# Altium project ESP32_Projet.PrjPcb
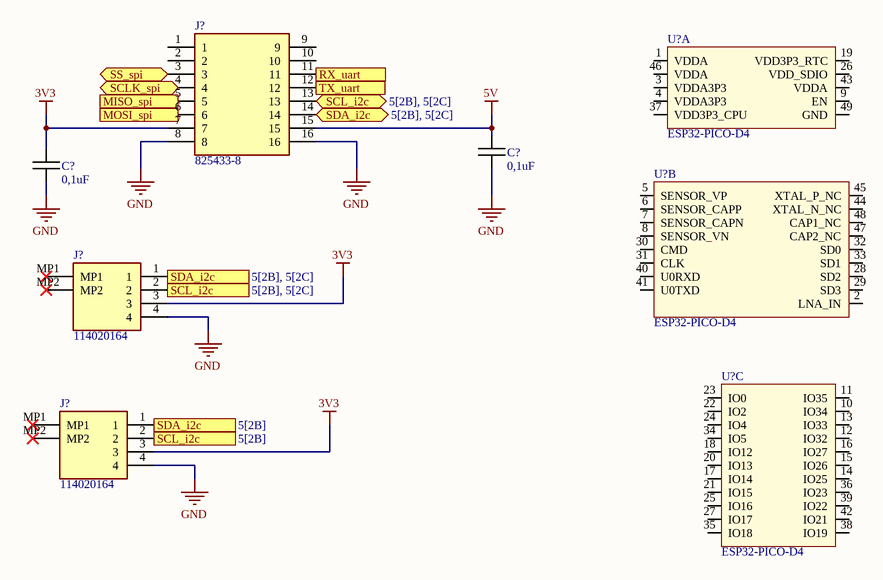
[diagram p0: Sheet6.SchDoc]
5 sheets, 60 parts. Net scope: flat (ports and power ports of the same name join across sheets).
Board file: PCB1.PcbDoc
Sheets:
  Sheet6.SchDoc
  Sheet1.SchDoc
  Sheet2.SchDoc
  Sheet3.SchDoc
  Sheet5.SchDoc

## Sheet Sheet6.SchDoc
size A4; SheetNumber: 5; SheetTotal: 5

### Parts
(Parts that share a designator on the sheet are numbered #1, #2 ... from top to bottom, then left to right.)
C?#1  0,1uF  [CAPC1005X06N]
C?#2  0,1uF  [CAPC1005X06N]
J?#1  825433-8
J?#2  114020164  [114020164]
J?#3  114020164  [114020164]
U?#1  ESP32-PICO-D4  [PQFN50P700X700X104_HS-49N]  (part A of 3)
U?#2  ESP32-PICO-D4  [PQFN50P700X700X104_HS-49N]  (part B of 3)
U?#3  ESP32-PICO-D4  [PQFN50P700X700X104_HS-49N]  (part C of 3)

### Ports
MISO_spi (in), MOSI_spi (out), RX_uart (in), SCL_i2c (bidir, see 5[2B], 5[2C]), SCL_i2c (in, see 5[2B]), SCL_i2c (in, see 5[2B], 5[2C]), SCLK_spi (bidir), SDA_i2c (bidir, see 5[2B], 5[2C]), SDA_i2c (out, see 5[2B]), SDA_i2c (out, see 5[2B], 5[2C]), SS_spi (bidir), TX_uart (out)

### Nets
3V3: C?#2.1 J?#1.7 J?#2.3 J?#3.3
5V: C?#1.1 J?#1.15
GND: C?#1.2 C?#2.2 J?#1.8 J?#1.16 J?#2.4 J?#3.4
NetJ?#1_3: J?#1.3 ; port SS_spi
NetJ?#1_11: J?#1.11 ; port RX_uart
NetJ?#1_12: J?#1.12 ; port TX_uart
NetJ?#1_13: J?#1.13 J?#2.2 J?#3.2 ; port SCL_i2c
NetJ?#1_14: J?#1.14 J?#2.1 J?#3.1 ; port SDA_i2c

Not connected (* = marked no-connect by the designer): J?#1 1 2 4 5 6 9 10; J?#2 MP1* MP2*; J?#3 MP1* MP2*; U?#1 1(VDDA) 3(VDDA3P3) 4(VDDA3P3) 9(EN) 19(VDD3P3_RTC) 26(VDD_SDIO) 37(VDD3P3_CPU) 43(VDDA) 46(VDDA) 49(GND); U?#2 2(LNA_IN) 5(SENSOR_VP) 6(SENSOR_CAPP) 7(SENSOR_CAPN) 8(SENSOR_VN) 28(SD2) 29(SD3) 30(CMD) 31(CLK) 32(SD0) 33(SD1) 40(U0RXD) 41(U0TXD) 44(XTAL_N_NC) 45(XTAL_P_NC) 47(CAP2_NC) 48(CAP1_NC); U?#3 10(IO34) 11(IO35) 12(IO32) 13(IO33) 14(IO25) 15(IO26) 16(IO27) 17(IO14) 18(IO12) 20(IO13) 21(IO15) 22(IO2) 23(IO0) 24(IO4) 25(IO16) 27(IO17) 34(IO5) 35(IO18) 36(IO23) 38(IO19) 39(IO22) 42(IO21)

### Library data of the parts
C?#1 C?#2 = Capacitor
J?#1 = Connect-Mikronus: Headers & Wire Housings 8P double for connection mikrobus; Manufacturer_Name: TE Connectivity; Manufacturer_Part_Number: 825433-8; Mouser Part Number: 571-825433-8
J?#2 J?#3 = 114020164: Seeed Studio Accessories Grove Female Header - SMD-4P-2.0mm-90D-20Pcs; Manufacturer_Name: Seeed Studio; Manufacturer_Part_Number: 114020164; Mouser Part Number: 713-114020164
U?#1-U?#3 = ESP32: Système RF sur puce - SoC SIP module ESP32 with 4MByte Flash, Dual Core MCU, Wi-Fi & Bluetooth Combo, LGA48-pin, 7*7mm; Manufacturer 1: Espressif Systems; Supplier 1: Digi-Key; Supplier Part Number 1: 1904-1029-1-ND; Manufacturer Part Number 1: ESP32-PICO-D4

## Sheet Sheet1.SchDoc: Projet M1 2024
size A4; DrawnBy: J.CLEMENT & D.FOURNIER; DocumentNumber: 1; Revision: V1.0 Rev A; SheetNumber: 2; SheetTotal: 5
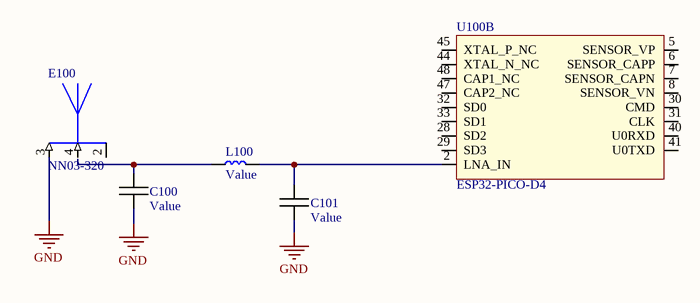
[diagram p1: Sheet1.SchDoc]

### Parts
C100  Value  [CAPC1005X06N]
C101  Value  [CAPC1005X06N]
E100  NN03-320  [XCVR_NN03-320]
L100  Value  [LQPC1005X06N]
U100  ESP32-PICO-D4  [PQFN50P700X700X104_HS-49N]  (part B of 3)

### Nets
GND: C100.2 C101.2 E100.3(FEED_BLUETOOTH)
NetC100_1: C100.1 L100.1
NetC101_1: C101.1 L100.2 U100.2(LNA_IN)

Not connected (* = marked no-connect by the designer): E100 2(GROUND) 4(FEED_GNSS); U100 5(SENSOR_VP) 6(SENSOR_CAPP) 7(SENSOR_CAPN) 8(SENSOR_VN) 28(SD2) 29(SD3) 30(CMD) 31(CLK) 32(SD0) 33(SD1) 40(U0RXD) 41(U0TXD) 44(XTAL_N_NC) 45(XTAL_P_NC) 47(CAP2_NC) 48(CAP1_NC)

### Library data of the parts
C100 C101 = Capacitor
E100 = NN03-320: Dual port antenna booster for GNSS, Bluetooth, 5G and UWB (1561 - 1606MHz, 2400 - 2500MHz, 3400 - 3800MHz, 3100 - 4800MHz and 6000 - 10600 MHz), signal booster; Manufacturer_Name: Ignion; Manufacturer_Part_Number: NN03-320; Mouser Part Number: 128-NN03-320
L100 = Bobine
U100 = ESP32: as U?#1 on sheet Sheet6; Supplier 1: Digi-Key; Supplier Part Number 1: 1904-1029-1-ND; Manufacturer Part Number 1: ESP32-PICO-D4

## Sheet Sheet2.SchDoc: Alimentation
size A4; Date: 25/11/2024; Author: Lucas Taraire; DrawnBy: Lucas Taraire; SheetNumber: 3; SheetTotal: 5
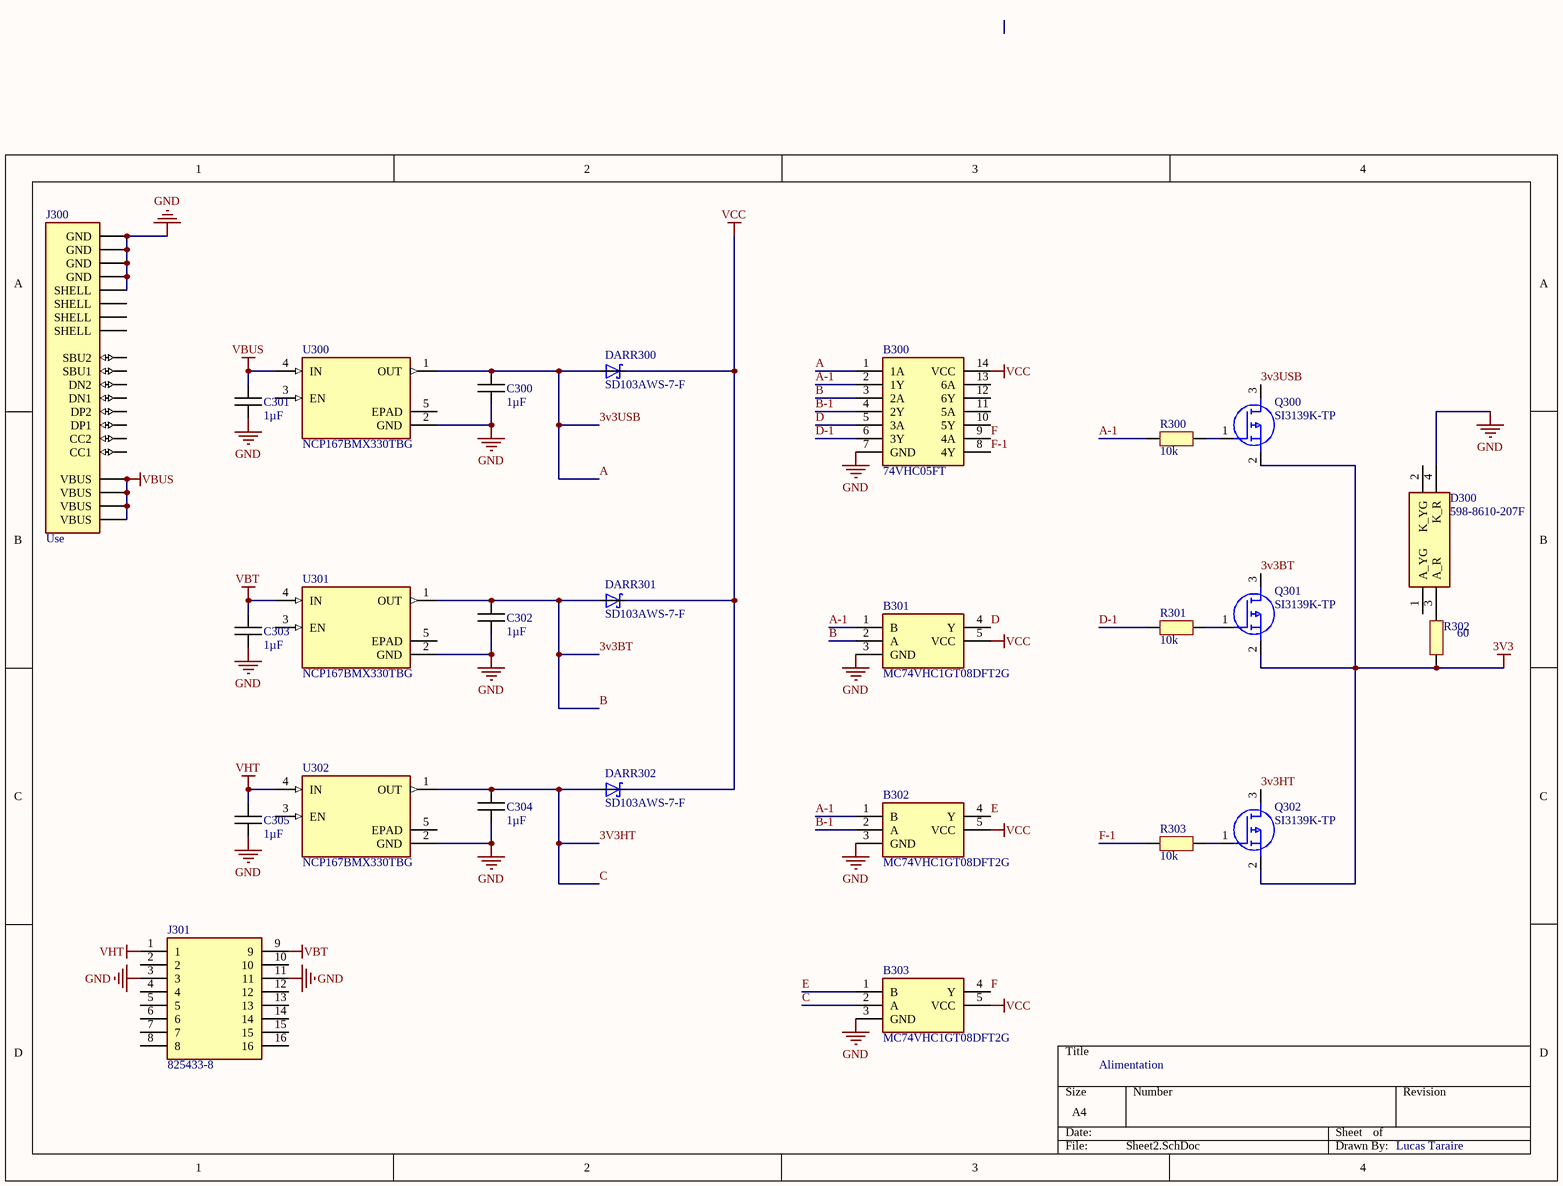
[diagram p2: Sheet2.SchDoc]

### Parts
B300  74VHC05FT  [SOP65P640X120-14N]
B301  MC74VHC1GT08DFT2G  [SOT65P210X110-5N]
B302  MC74VHC1GT08DFT2G  [SOT65P210X110-5N]
B303  MC74VHC1GT08DFT2G  [SOT65P210X110-5N]
C300  1µF  [CAPC1005X06N]
C301  1µF  [CAPC1005X06N]
C302  1µF  [CAPC1005X06N]
C303  1µF  [CAPC1005X06N]
C304  1µF  [CAPC1005X06N]
C305  1µF  [CAPC1005X06N]
D300  598-8610-207F  [5988610207F]
DARR300  SD103AWS-7-F  [SD103AWS-7-F]
DARR301  SD103AWS-7-F  [SD103AWS-7-F]
DARR302  SD103AWS-7-F  [SD103AWS-7-F]
J300  Use  [USB4085-GF-A]
J301  825433-8
Q300  SI3139K-TP  [SI3139K-TP]
Q301  SI3139K-TP  [SI3139K-TP]
Q302  SI3139K-TP  [SI3139K-TP]
R300  10k  [RESC1005X06N]
R301  10k  [RESC1005X06N]
R302  60  [RESC1005X06N]
R303  10k  [RESC1005X06N]
U300  NCP167BMX330TBG  [NCP167BMX330TBG]
U301  NCP167BMX330TBG  [NCP167BMX330TBG]
U302  NCP167BMX330TBG  [NCP167BMX330TBG]

### Nets
3V3: Q300.2(S) Q301.2(S) Q302.2(S) R302.1
GND: B300.7(GND) B301.3(GND) B302.3(GND) B303.3(GND) C300.2 C301.2 C302.2 C303.2 C304.2 C305.2 D300.4(K_R) J300.A1(GND) J300.A12(GND) J300.B1(GND) J300.B12(GND) J300.S4(SHELL) J301.3 J301.11 U300.2(GND) U301.2(GND) U302.2(GND)
VBT: C303.1 J301.9 U301.4(IN)
VBUS: C301.1 J300.A4(VBUS) J300.A9(VBUS) J300.B4(VBUS) J300.B9(VBUS) U300.4(IN)
VCC: B300.14(VCC) B301.5(VCC) B302.5(VCC) B303.5(VCC) DARR300.1(C) DARR301.1(C) DARR302.1(C)
VHT: C305.1 J301.1 U302.4(IN)
3v3BT: B300.3(2A) B301.2(A) C302.1 DARR301.2(A) Q301.3(D) U301.1(OUT)  [also labelled B]
3V3HT: B303.2(A) C304.1 DARR302.2(A) Q302.3(D) U302.1(OUT)  [also labelled C]
3v3USB: B300.1(1A) C300.1 DARR300.2(A) Q300.3(D) U300.1(OUT)  [also labelled A]
A-1: B300.2(1Y) B301.1(B) B302.1(B) R300.1
B-1: B300.4(2Y) B302.2(A)
D: B300.5(3A) B301.4(Y)
D-1: B300.6(3Y) R301.1
E: B302.4(Y) B303.1(B)
F: B300.9(4A) B303.4(Y)
F-1: B300.8(4Y) R303.1
NetQ300_1: Q300.1(G) R300.2
NetQ301_1: Q301.1(G) R301.2
NetQ302_1: Q302.1(G) R303.2

Not connected (* = marked no-connect by the designer): B300 10(5Y) 11(5A) 12(6Y) 13(6A); D300 1(A_YG) 2(K_YG) 3(A_R); J300 A5(CC1) A6(DP1) A7(DN1) A8(SBU1) B5(CC2) B6(DP2) B7(DN2) B8(SBU2) S1(SHELL) S2(SHELL) S3(SHELL); J301 2 4 5 6 7 8 10 12 13 14 15 16; R302 2; U300 3(EN) 5(EPAD); U301 3(EN) 5(EPAD); U302 3(EN) 5(EPAD)

### Library data of the parts
B300 = 74VHC05FT: Logic Gates CMOS LOGIC IC INVERTER; Manufacturer_Name: Toshiba; Manufacturer_Part_Number: 74VHC05FT; Mouser Part Number: 757-74VHC05FT
B301-B303 = MC74VHC1GT08DFT2G: Single 2-Input AND Gate, TTL Level; Manufacturer_Name: onsemi; Manufacturer_Part_Number: MC74VHC1GT08DFT2G; Parameter 3: *
C300-C305 = Capacitor
D300 = 598-8610-207F: Standard LEDs - SMD Red/Green WC 80/50mcd 645/570nm; Manufacturer_Name: Dialight; Geometry.Height: 0.8mm; Manufacturer_Part_Number: 598-8610-207F; Mouser Part Number: 645-598-8610-207F; Mouser Price/Stock: https://www.mouser.co.uk/ProductDetail/Dialight/598-8610-207F?qs=7JStj%2FjQ2SFuCjosqwklHQ%3D%3D; Arrow Part Number: 598-8610-207F; Arrow Price/Stock: https://www.arrow.com/en/products/598-8610-207f/dialight?region=nac; Datasheet Link: https://media.digikey.com/pdf/Data%20Sheets/Dialight%20PDFs/598%20Series%201210%20Pkg%20Bi-Color.pdf
DARR300-DARR302 = SD103AWS-7-F: Diode Array 3 Independent Schottky 40V 175mA Surface Mount 6-TSSOP, SC-88, SOT-363
J300 = USB4085-GF-A: Connecteurs USB USB Type C, 2.0, Rec, TH , G/F, RA , Top Mnt, T & R
J301 = Connect-Mikronus: as J?#1 on sheet Sheet6; Manufacturer_Part_Number: 825433-8; Mouser Part Number: 571-825433-8
Q300-Q302 = SI3139K-TP: MOSFET P-Channel MOSFET
R300-R303 = Resistor
U300-U302 = NCP167BMX330TBG: Régulateurs de tension LDO LDO 700 MA ULTRA-LOW NOISE 3.3V

## Sheet Sheet3.SchDoc
size A4; SheetNumber: 4; SheetTotal: 5
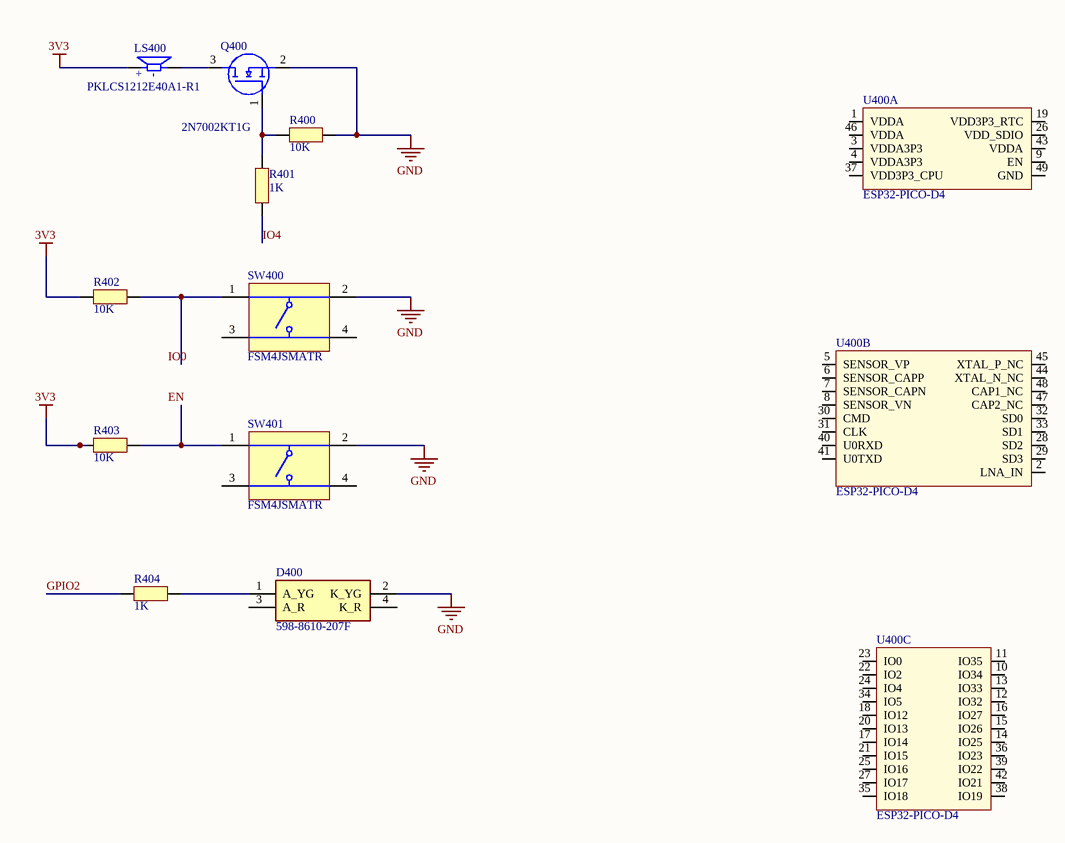
[diagram p3: Sheet3.SchDoc]

### Parts
D400  598-8610-207F  [5988610207F]
LS400  PKLCS1212E40A1-R1  [SPKR_PKLCS1212E40A1-R1]
Q400  2N7002KT1G  [SOT96P237X111-3N]
R400  10K  [RESC1005X06N]
R401  1K  [RESC1005X06N]
R402  10K  [RESC1005X06N]
R403  10K  [RESC1005X06N]
R404  1K  [RESC1005X06N]
SW400  FSM4JSMATR  [TECO-FSM4JSMATR_V]
SW401  FSM4JSMATR  [TECO-FSM4JSMATR_V]
U400  ESP32-PICO-D4  [PQFN50P700X700X104_HS-49N]  (parts A,B,C of 3)

### Nets
3V3: LS400.P R402.2 R403.2
GND: D400.2(K_YG) Q400.2(S) R400.2 SW400.2 SW401.2
GPIO2: R404.2
IO4: R401.1
NetD400_1: D400.1(A_YG) R404.1
NetLS400_N: LS400.N Q400.3(D)
NetQ400_1: Q400.1(G) R400.1 R401.2
NetR402_1: R402.1 SW400.1
NetR403_1: R403.1 SW401.1

Not connected (* = marked no-connect by the designer): D400 3(A_R) 4(K_R); SW400 3 4; SW401 3 4; U400 1(VDDA) 2(LNA_IN) 3(VDDA3P3) 4(VDDA3P3) 5(SENSOR_VP) 6(SENSOR_CAPP) 7(SENSOR_CAPN) 8(SENSOR_VN) 9(EN) 10(IO34) 11(IO35) 12(IO32) 13(IO33) 14(IO25) 15(IO26) 16(IO27) 17(IO14) 18(IO12) 19(VDD3P3_RTC) 20(IO13) 21(IO15) 22(IO2) 23(IO0) 24(IO4) 25(IO16) 26(VDD_SDIO) 27(IO17) 28(SD2) 29(SD3) 30(CMD) 31(CLK) 32(SD0) 33(SD1) 34(IO5) 35(IO18) 36(IO23) 37(VDD3P3_CPU) 38(IO19) 39(IO22) 40(U0RXD) 41(U0TXD) 42(IO21) 43(VDDA) 44(XTAL_N_NC) 45(XTAL_P_NC) 46(VDDA) 47(CAP2_NC) 48(CAP1_NC) 49(GND)

### Notes on the sheet
- Labels drawn without touching a wire or pin: EN, IO0
- (in symbol PKLCS1212E40A1-R1) +; -

### Library data of the parts
D400 = 598-8610-207F: as D300 on sheet Sheet2; Manufacturer_Part_Number: 598-8610-207F; Mouser Part Number: 645-598-8610-207F; Mouser Price/Stock: https://www.mouser.co.uk/ProductDetail/Dialight/598-8610-207F?qs=7JStj%2FjQ2SFuCjosqwklHQ%3D%3D; Arrow Part Number: 598-8610-207F; Arrow Price/Stock: https://www.arrow.com/en/products/598-8610-207f/dialight?region=nac; Datasheet Link: https://media.digikey.com/pdf/Data%20Sheets/Dialight%20PDFs/598%20Series%201210%20Pkg%20Bi-Color.pdf
LS400 = PKLCS1212E40A1-R1: Buzzers Transducer, Externally Driven Piezo 1.5V 2kHz 70dB @ 1.5V, 10cm Surface Mount Solder Pads; MF: Murata Electronics; Value: *; MP: PKLCS1212E40A1-R1; Package: None; Availability: Unavailable; Price: None
Q400 = 2N7002KT1G: MOSFET N-Ch 60V 380mA Small Signal SOT23 ON Semiconductor 2N7002KT1G N-channel MOSFET Transistor, 380 mA, 60 V, 3-Pin SOT-23; Manufacturer_Name: onsemi; Geometry.Height: 1.11mm; Manufacturer_Part_Number: 2N7002KT1G; Mouser Part Number: 863-2N7002KT1G; Mouser Price/Stock: https://www.mouser.co.uk/ProductDetail/onsemi/2N7002KT1G?qs=Jh7l0IbPjifUiTytu%252BGGDQ%3D%3D; Arrow Part Number: 2N7002KT1G; Arrow Price/Stock: https://www.arrow.com/en/products/2n7002kt1g/on-semiconductor?utm_currency=USD&region=nac; Datasheet Link: http://www.onsemi.com/pub/Collateral/2N7002K-D.PDF
R400-R404 = Resistor
SW400 SW401 = CMP-2000-07486-1: Micro Miniature Push Button Switch FSM JSM, 50 mA, -35 to 85 degC, 4-Pin SMD, RoHS, Tape and Reel; Manufacturer: TE Connectivity; Mechanical Life: 100000Cycles; Current Rating: 50mA; Actuator Material: Polyamide; Max Voltage Rating (DC): 12V; Capacitance: 0f; Illumination Type: Illuminated; Voltage Rating (DC): 24V; Case\/Package: SMD/SMT; Operating Force: 160gf; Contact Resistance: 100mOhm; Actuator Length: 0.055inch; Switch Travel: 0.25mm; Throw Configuration: SPST; Termination: GullWing; Contact Plating: Silver; Orientation: Straight; Mounting Technology: SurfaceMount; REACH SVHC: Unknown; Electrical Life: 100000Cycles; Package Reference: FSM4JSMATR; Max Operating Temperature: 85degC; Manufacturer URL: http://www.te.com/; Package Description: 4-Pin Surface Mount Device, Body 6 x 6 mm, Pitch 4.5 mm; Datasheet Version: Rev. V, 02/2015; Packaging: TapeandReel; Min Operating Temperature: -35degC; Mount: SurfaceMount; Contact Current Rating: 50mA; Contact Material: CopperAlloy; Package Quantity: 1200; Datasheet URL: http://www.te.com/commerce/DocumentDelivery/DDEController?Action=showdoc&DocId=Customer+Drawing%7F2-1437565-7%7FV%7Fpdf%7FEnglish%7FENG_CD_2-1437565-7_V.pdf%7F4-1437565-2; RoHSCompliant: true
U400 = ESP32: as U?#1 on sheet Sheet6; Supplier 1: Digi-Key; Supplier Part Number 1: 1904-1029-1-ND; Manufacturer Part Number 1: ESP32-PICO-D4

## Sheet Sheet5.SchDoc
size A4; SheetNumber: 5; SheetTotal: 5
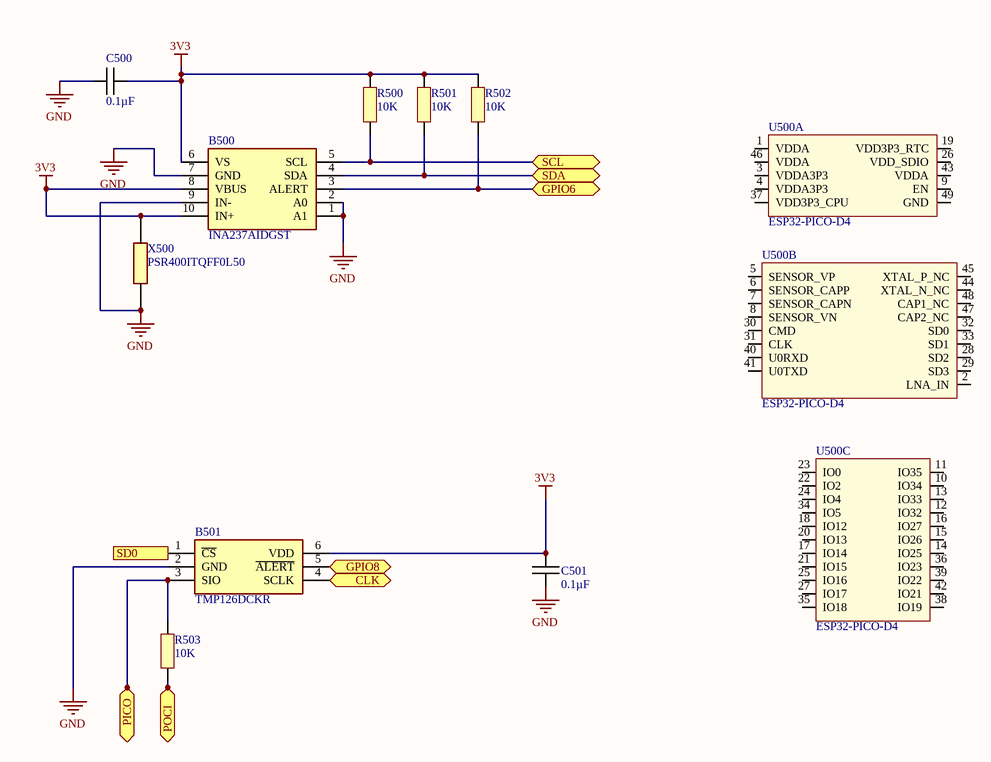
[diagram p4: Sheet5.SchDoc]

### Parts
B500  INA237AIDGST  [SOP50P490X110-10N]
B501  TMP126DCKR  [SOT65P210X110-6N]
C500  0.1µF  [CAPC1005X06N]
C501  0.1µF  [CAPC1005X06N]
R500  10K  [RESC1005X06N]
R501  10K  [RESC1005X06N]
R502  10K  [RESC1005X06N]
R503  10K  [RESC1005X06N]
U500  ESP32-PICO-D4  [PQFN50P700X700X104_HS-49N]  (parts A,B,C of 3)
X500  PSR400ITQFF0L50  [RESC10052X200N]

### Ports
CLK (bidir), GPIO6 (bidir), GPIO8 (bidir), PICO (bidir), POCI (bidir), SCL (bidir), SD0 (in), SDA (bidir)

### Nets
3V3: B500.6(VS) B500.8(VBUS) B500.10(IN+) B501.6(VDD) C500.2 C501.2 R500.2 R501.2 R502.2 X500.2
GND: B500.1(A1) B500.2(A0) B500.7(GND) B500.9(IN-) B501.2(GND) C500.1 C501.1 X500.1
NetB500_3: B500.3(ALERT) R502.1 ; port GPIO6
NetB500_4: B500.4(SDA) R501.1 ; port SDA
NetB500_5: B500.5(SCL) R500.1 ; port SCL
NetB501_1: B501.1(~{CS}) ; port SD0
NetB501_3: B501.3(SIO) R503.1 ; port PICO
NetB501_4: B501.4(SCLK) ; port CLK
NetB501_5: B501.5(~{ALERT}) ; port GPIO8
NetR503_2: R503.2 ; port POCI

Not connected (* = marked no-connect by the designer): U500 1(VDDA) 2(LNA_IN) 3(VDDA3P3) 4(VDDA3P3) 5(SENSOR_VP) 6(SENSOR_CAPP) 7(SENSOR_CAPN) 8(SENSOR_VN) 9(EN) 10(IO34) 11(IO35) 12(IO32) 13(IO33) 14(IO25) 15(IO26) 16(IO27) 17(IO14) 18(IO12) 19(VDD3P3_RTC) 20(IO13) 21(IO15) 22(IO2) 23(IO0) 24(IO4) 25(IO16) 26(VDD_SDIO) 27(IO17) 28(SD2) 29(SD3) 30(CMD) 31(CLK) 32(SD0) 33(SD1) 34(IO5) 35(IO18) 36(IO23) 37(VDD3P3_CPU) 38(IO19) 39(IO22) 40(U0RXD) 41(U0TXD) 42(IO21) 43(VDDA) 44(XTAL_N_NC) 45(XTAL_P_NC) 46(VDDA) 47(CAP2_NC) 48(CAP1_NC) 49(GND)

### Library data of the parts
B500 = INA237AIDGST: Current Sense Amplifiers 85-V, 16-bit, I2C output current/voltage/power monitor with alert 10-VSSOP -40 to 125; Manufacturer_Name: Texas Instruments; Manufacturer_Part_Number: INA237AIDGST; Mouser Part Number: 595-INA237AIDGST
B501 = TMP126DCKR: Board Mount Temperature Sensors +/-0.25 C SPI temperature sensor with 175 C operation, CRC and slew-rate alert; Manufacturer_Name: Texas Instruments; Manufacturer_Part_Number: TMP126DCKR; Mouser Part Number: 595-TMP126DCKR
C500 C501 = Capacitor
R500-R503 = Resistor
U500 = ESP32: as U?#1 on sheet Sheet6; Supplier 1: Digi-Key; Supplier Part Number 1: 1904-1029-1-ND; Manufacturer Part Number 1: ESP32-PICO-D4
X500 = PSR400ITQFF0L50: ROHM - PSR400ITQFF0L50 - SMD Current Sense Resistor, 500 ohm, PSR Series, 3921 [1052 Metric], 4 W, +/- 1%, Metal Strip; Manufacturer_Name: ROHM Semiconductor; Geometry.Height: 2mm; Manufacturer_Part_Number: PSR400ITQFF0L50; Mouser Part Number: 755-PSR400ITQFF0L50; Mouser Price/Stock: https://www.mouser.co.uk/ProductDetail/ROHM-Semiconductor/PSR400ITQFF0L50?qs=493kPxzlxfLaT1w5Mo%252BtHg%3D%3D; Arrow Part Number: *; Arrow Price/Stock: *; Datasheet Link: https://componentsearchengine.com/Datasheets/2/PSR400ITQFF0L50.pdf

## Nets that join several sheets
3V3: Sheet6 (C?#2.1 J?#1.7 J?#2.3 J?#3.3), Sheet2 (Q300.2 Q301.2 Q302.2 R302.1), Sheet3 (LS400.P R402.2 R403.2), Sheet5 (10 pins)
GND: Sheet6 (6 pins), Sheet1 (C100.2 C101.2 E100.3), Sheet2 (21 pins), Sheet3 (5 pins), Sheet5 (8 pins)